# EAGLE design MasterThesis (EAGLE 6.2)
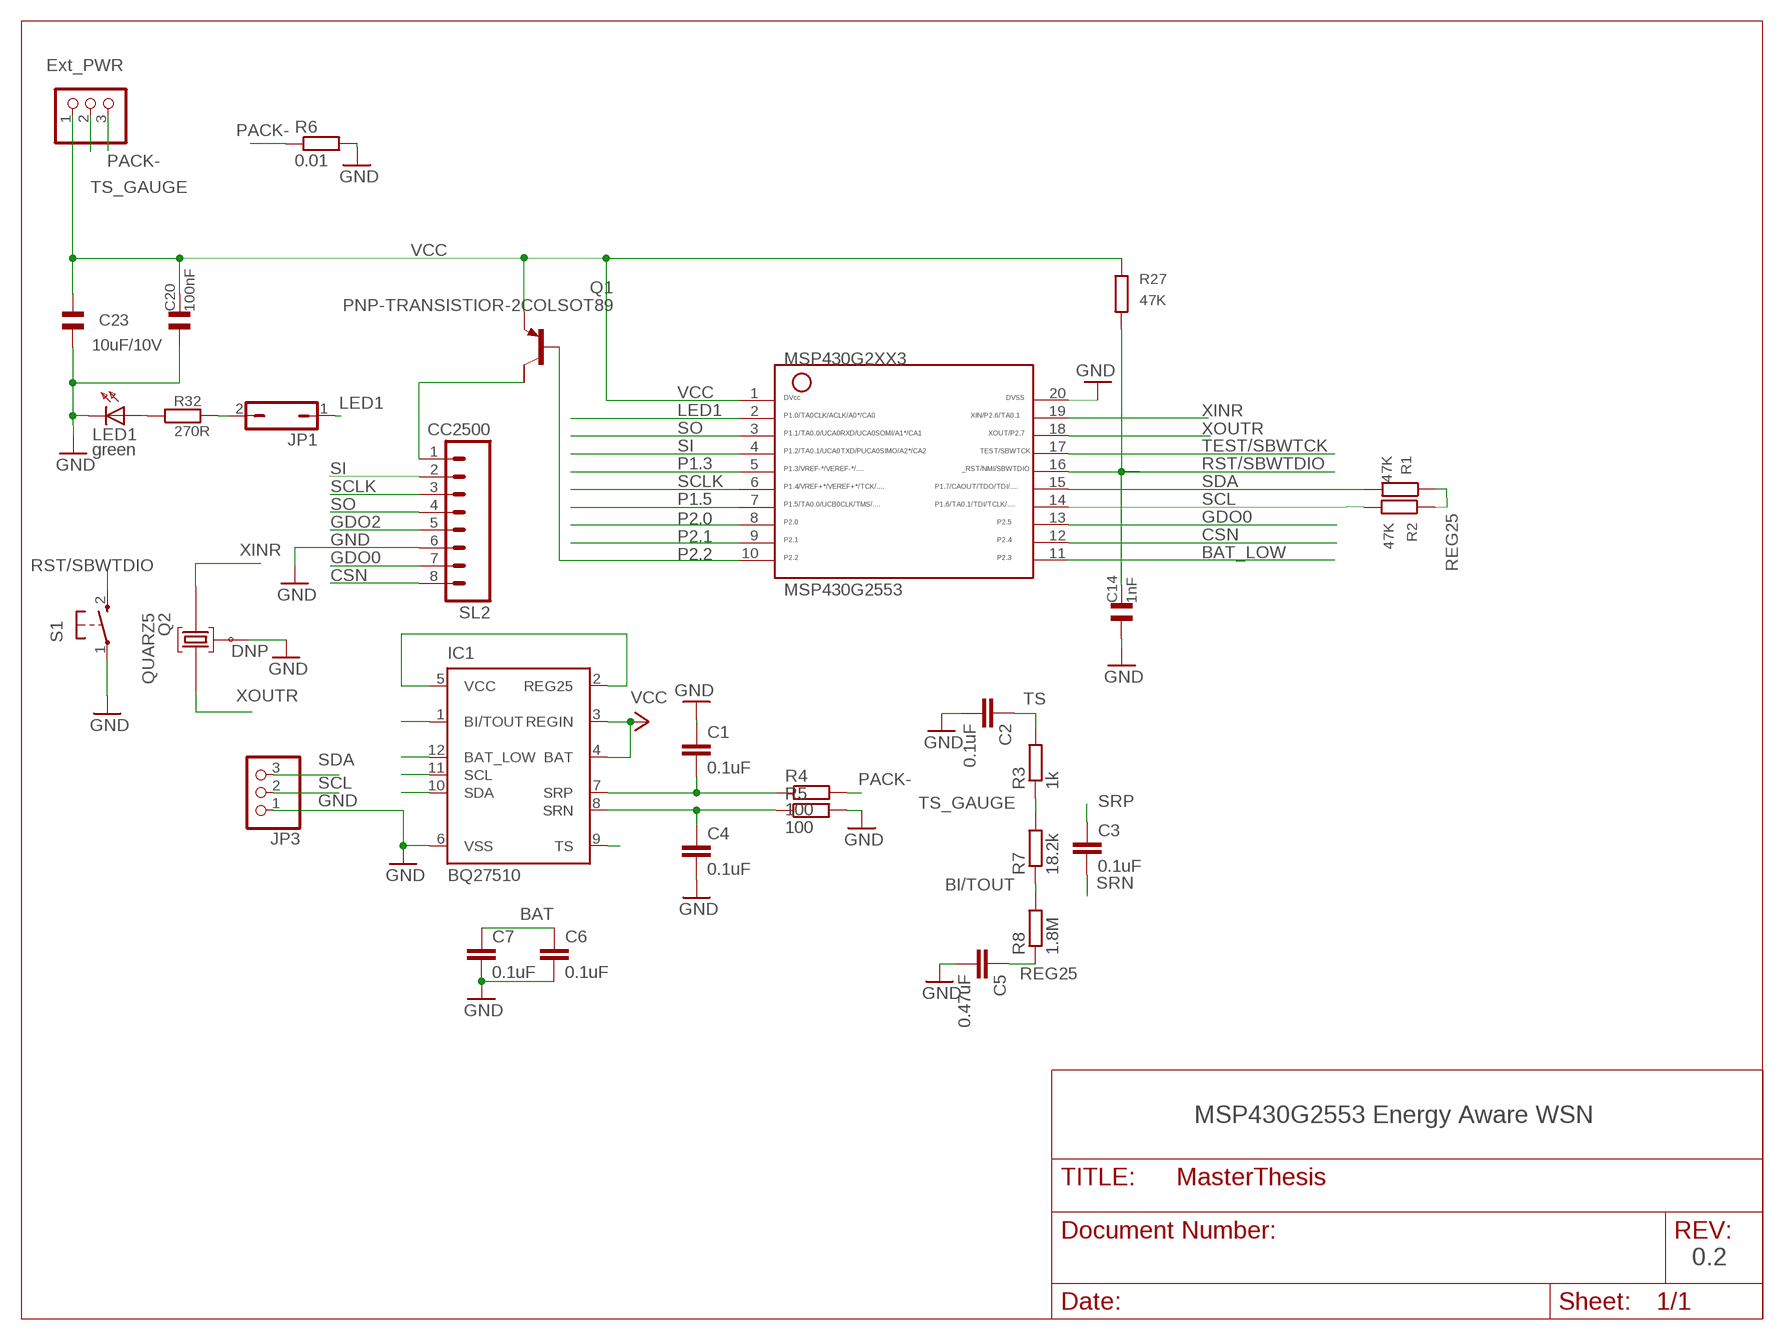
[diagram p0: schematic, sheet 1]

## Parts
C1  0.1uF  C-EU025-024X044  [C025-024X044]
C2  0.1uF  C-EU025-024X044  [C025-024X044]
C3  0.1uF  C-EU025-024X044  [C025-024X044]
C4  0.1uF  C-EU025-024X044  [C025-024X044]
C5  0.47uF  C-EU025-024X044  [C025-024X044]
C6  0.1uF  C-EU025-024X044  [C025-024X044]
C7  0.1uF  C-EU025-024X044  [C025-024X044]
C14  1nF  C_SMD0603  [0603]
C20  100nF  C_SMD0603  [0603]
C23  10uF/10V  C_0805  [0805]
IC1  BQ27510  [DRZ]
J6  PINHD-1X3  [1X03]
JP1  JP1Q  [JP1]
JP3  PINHD-1X3/90  [1X03/90]
LED1  green  LED_0603D0603  [DIODE0603]
MSP430G2553  MSP430G2553  G2XX3---N20  [N20]
Q1  PNP-TRANSISTIOR-2COLSOT89  [SOT89]
Q2  QUARZ5  [QUARZ5]
R1  47K  R_SMDR0603  [0603]
R2  47K  R_SMDR0603  [0603]
R3  1k  R-EU_0204/5  [0204/5]
R4  100  R-EU_0204/5  [0204/5]
R5  100  R-EU_0204/5  [0204/5]
R6  0.01  R-EU_0204/5  [0204/5]
R7  18.2k  R-EU_0204/5  [0204/5]
R8  1.8M  R-EU_0204/5  [0204/5]
R27  47K  R_SMDR0603  [0603]
R32  270R  R_SMDR0603  [0603]
S1  PB  [PBTH]
SL2  CC2500  M08  [08P]

## Nets
BAT: C6.1 C7.1 IC1.3(REGIN) IC1.4(BAT) ; supply symbol labelled VCC
BAT_LOW: IC1.12(BAT_LOW) MSP430G2553.11
BI/TOUT: IC1.1(BI/TOUT) R7.1 R8.2
CSN: MSP430G2553.12 SL2.8
GDO0: MSP430G2553.13 SL2.7
GDO2: SL2.5
GND [Ground]: C1.1 C2.2 C4.2 C5.2 C6.2 C7.2 C14.1 C20.1 C23.1 IC1.6(VSS) JP3.1 LED1.K(C) MSP430G2553.20 Q2.GND@0 R5.2 R6.2 S1.1(P) SL2.6
LED1: JP1.1 MSP430G2553.2
N$1: Q1.2(C) SL2.1
N$2: JP1.2 R32.2
N$34: LED1.A R32.1
P1.3: MSP430G2553.5
P1.5: MSP430G2553.7
P2.0: MSP430G2553.8
P2.1: MSP430G2553.9
P2.2: MSP430G2553.10 Q1.1(B)
PACK- [Ground]: J6.3 R4.2 R6.1
REG25: C5.1 IC1.2(REG25) IC1.5(VCC) R1.1 R2.1 R8.1
RST/SBWTDIO: C14.2 MSP430G2553.16 R27.2 S1.2(S)
SCL: IC1.11(SCL) JP3.2 MSP430G2553.14 R2.2
SCLK: MSP430G2553.6 SL2.3
SDA: IC1.10(SDA) JP3.3 MSP430G2553.15 R1.2
SI: MSP430G2553.4 SL2.2
SO: MSP430G2553.3 SL2.4
SRN: C3.2 C4.1 IC1.8(SRN) R5.1
SRP: C1.2 C3.1 IC1.7(SRP) R4.1
TEST/SBWTCK: MSP430G2553.17
TS: C2.1 IC1.9(TS) R3.2
TS_GAUGE [Ground]: J6.2 R3.1 R7.2
VCC: C20.2 C23.2 J6.1 MSP430G2553.1 Q1.3(E) R27.1
XINR: MSP430G2553.19 Q2.2
XOUTR: MSP430G2553.18 Q2.1
Unconnected: Q1.2@1(C/)

## Notes on the sheet
- Ext_PWR
- DNP
- MSP430G2553 Energy Aware WSN
- 0.2

## Power pins joined to a net without a drawn wire
PWPD: IC1.EXP@1(PWPD) IC1.EXP@2(PWPD) IC1.EXP@3(PWPD) IC1.EXP@4(PWPD) IC1.EXP@5(PWPD) IC1.EXP@6(PWPD) IC1.EXP@7(PWPD) IC1.EXP@8(PWPD) IC1.EXP@9(PWPD)

## Library data of the parts
C1-C7 = rcl:C-EU: CAPACITOR, European symbol
C14 C20 = ssmd:C_SMD
C23 = ssmd:C_0805
IC1 = texas:BQ27510: System-Side Impedance Track? Fuel Gauge Source: bq27500-v100.pdf; MPN: BQ27510DRZT; OC_FARNELL: 1710789; OC_NEWARK: 50P9379
J6 JP3 = pinhead:PINHD-1X3: PIN HEADER
JP1 = jumper:JP1Q: JUMPER
LED1 = smd:LED_0603
MSP430G2553 = TI_MSP430_v16:G2XX3---N20: MSP430G2XX1 PDIP (N) 20 Pin Package
Q1 = semicon-smd-ipc:PNP-TRANSISTIOR-2COL: PNP TRANSISTOR 2 colletor pins
Q2 = sMSP430:QUARZ5
R1 R2 R27 R32 = ssmd:R_SMD
R3-R8 = rcl:R-EU_: RESISTOR, European symbol
S1 = electricalmeter:PB: OMRON SWITCH
SL2 = con-amp-quick:M08: AMP QUICK CONNECTOR; OC_FARNELL: unknown; OC_NEWARK: unknown

## Net classes
0 default: width 0.254 mm
1 Ground: width 0.1 mm, drill 0.2 mm

## Board
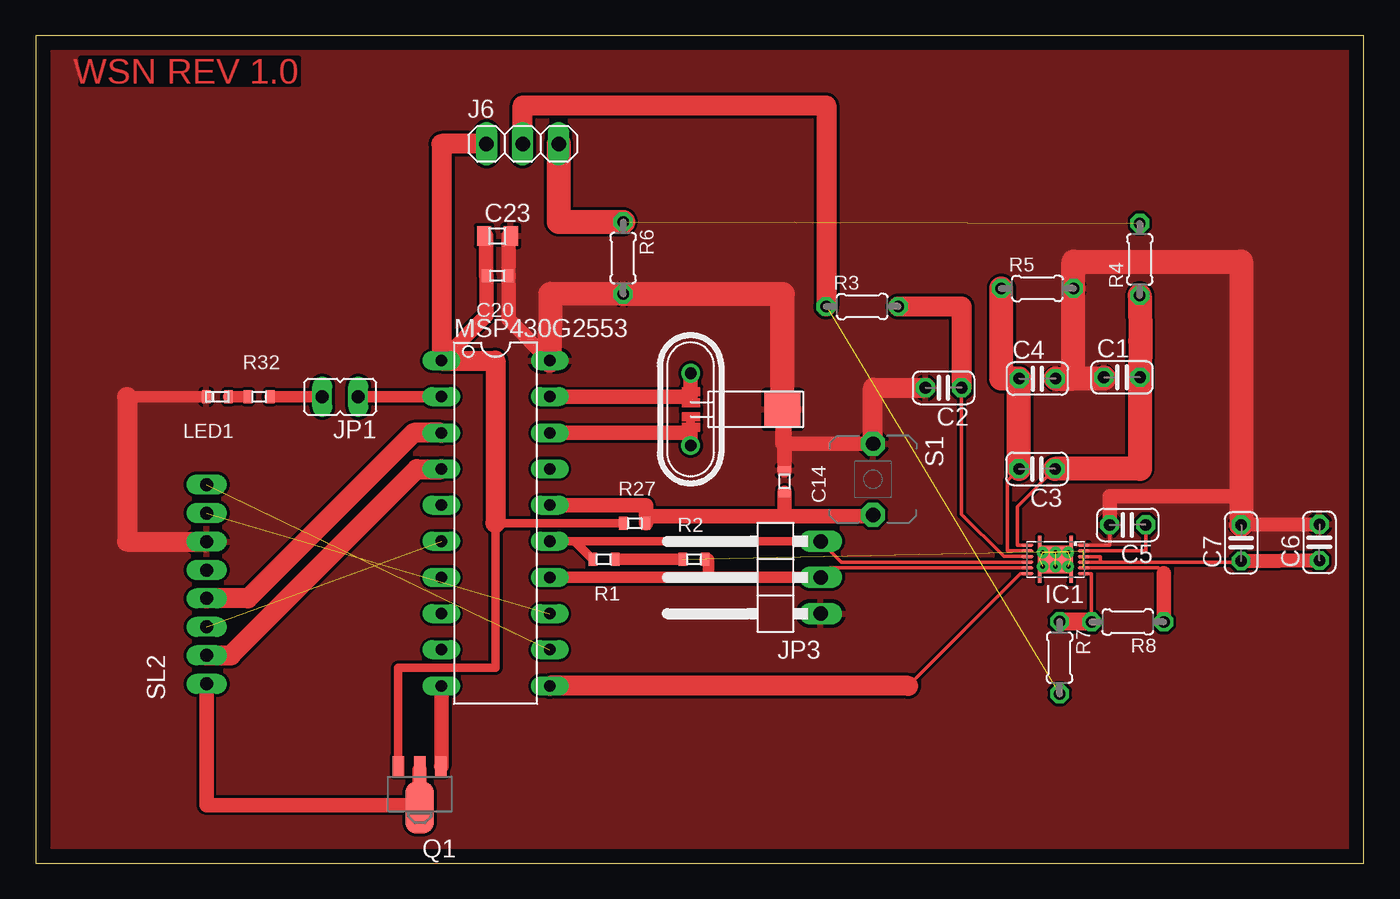
[diagram p1: board, top side]

Size 93.41 x 58.18 mm. Coordinates in mm from the lower left corner, seen from the top.
Outline: 0.01,0 93.41,0 93.41,58.18 0,58.18 0.01,0
Copper layers (1*16): Top 0.035mm / dielectric 1.5mm / Bottom 0.035mm
Design rules: minimum track width 10mil, minimum drill 24mil, track to track 8mil, track to pad 8mil, pad to pad 8mil, via to via 8mil, smd to smd 8mil, copper to edge 40mil, drill to drill 8mil, minimum pad ring 10mil, minimum via ring 8mil, stop-mask expansion 4mil, vias tented up to drill 0mil, thermal gap 10mil

### Footprints (pad centres in the part's own frame; a part is rotated, then mirrored left to right if it is on the bottom)
C025-024X044 = drill 0.813 octagon: 1 -1.27,0; 2 1.27,0
0603 = smd 0.6 x 0.9: 1 -0.787,0; 2 0.787,0
0805 = smd 1 x 1.4: 1 -0.94,0; 2 0.94,0
DRZ = smd 0.85 x 0.2: 1 -1.975,1; 2 -1.975,0.6; 3 -1.975,0.2; 4 -1.975,-0.2; 5 -1.975,-0.6; 6 -1.975,-1; 7 1.975,-1; 8 1.975,-0.6; 9 1.975,-0.2; 10 1.975,0.2; 11 1.975,0.6; 12 1.975,1 | smd 2.45 x 1.95: EXP@1 0,0 | smd 0.25 x 3.3: EXP@2 -1.1,0; EXP@3 1.1,0 | drill 0.3 pad 0.406: EXP@4 -0.9,0.5; EXP@5 0,0.5; EXP@6 0.9,0.5; EXP@7 -0.9,-0.5; EXP@8 0,-0.5; EXP@9 0.9,-0.5
1X03 = drill 1.016 long: 1 -2.54,0; 2 0,0; 3 2.54,0
JP1 = drill 0.914 long: 1 0,-1.27; 2 0,1.27
1X03/90 = drill 1.016 long: 1 -2.54,-3.81; 2 0,-3.81; 3 2.54,-3.81
DIODE0603 = smd 0.6 x 0.9: A -0.787,0; K 0.787,0
N20 = drill 0.813 long: 1 -11.435,-3.81; 2 -8.895,-3.81; 3 -6.355,-3.81; 4 -3.815,-3.81; 5 -1.275,-3.81; 6 1.265,-3.81; 7 3.805,-3.81; 8 6.345,-3.81; 9 8.885,-3.81; 10 11.425,-3.81; 11 11.425,3.81; 12 8.885,3.81; 13 6.345,3.81; 14 3.805,3.81; 15 1.265,3.81; 16 -1.275,3.81; 17 -3.815,3.81; 18 -6.355,3.81; 19 -8.895,3.81; 20 -11.435,3.81
SOT89 = smd 0.8 x 1.4: 1 -1.499,-1.981; 3 1.499,-1.981 | smd 0.8 x 1.9: 2 0,-1.727 | smd 2.032 x 3.65: 2@1 0,0.94
QUARZ5 = drill 0.813: 1 1.53,1.773; 2 1.52,-3.303 | smd 2.54 x 2.54: GND@0 -4.941,-0.762
0204/5 = drill 0.813 octagon: 1 -2.54,0; 2 2.54,0
PBTH = drill 1.016 pad 1.676 octagon: 1 -0.001,0.001; 2 5.001,0.001
08P = drill 0.914 long: 1 -8.78,0.026; 2 -6.776,0.022; 3 -4.778,0.022; 4 -2.773,0.023; 5 -0.775,0.021; 6 1.222,0.02; 7 3.23,0.024; 8 5.225,0.022; 9 -8.78,0.026; 10 -8.78,0.026; 11 -8.78,0.026; 12 -8.78,0.026; 13 -6.776,0.022; 14 -6.776,0.022; 15 -6.776,0.022; 16 -6.776,0.022; 17 -6.78,0.022; 18 -6.776,0.022; 19 -4.778,0.022; 20 -4.778,0.022; 21 -4.778,0.022; 22 -0.775,0.021; 23 -0.775,0.021

### Placement (x,y rotation side)
C1  76.39,34.16 0 top
C2  63.84,33.43 180 top
C3  70.42,27.72 180 top
C4  70.45,34.06 0 top
C5  76.8,23.79 180 top
C6  90.27,22.56 90 top
C7  84.77,22.52 90 top
C14  52.67,26.82 270 top
C20  32.47,41.3 180 top
C23  32.47,44.09 180 top
IC1  71.72,21.36 180 top
J6  34.25,50.57 0 top
JP1  21.42,32.79 90 top
JP3  51.4,20.09 90 top
LED1  12.79,32.79 180 top
MSP430G2553  32.35,23.9 270 top
Q1  27.01,4.85 180 top
Q2  47.59,31.14 180 top
R1  39.97,21.36 180 top
R2  46.29,21.36 0 top
R3  58.13,39.14 0 top
R4  77.65,42.44 90 top
R5  70.45,40.41 0 top
R6  41.31,42.55 270 top
R7  72.01,14.45 270 top
R8  76.8,16.97 180 top
R27  42.13,23.9 0 top
R32  15.71,32.79 0 top
S1  58.89,29.49 270 top
SL2  12.05,21.39 90 top

### Tracks (layer width: path | path; a pad name or v marks a point on that pad's centre or on a via)
BAT
  Top 0.254: C7.1 84.77,21.16 74.88,21.16 | 74.88,21.16 IC1.3 | IC1.4 74.88,21.56 74.88,21.16
  Top 1.016: C6.1 C7.1
BAT_LOW
  Top 0.254: IC1.12 69.26,20.36 61.37,12.47
  Top 1.422: 61.37,12.47 MSP430G2553.11
BI/TOUT
  Top 0.254: IC1.1 74.26,20.36 R8.2
  Top 1.27: R8.2 72.01,16.97 R7.1
CSN  (1 unrouted)
GDO0  (1 unrouted)
GND
  Top 0.254: C5.2 75.53,22.36 IC1.6
  Top 0.61: C23.1 33.26,44.09
  Top 0.813: 6.44,32.79 LED1.K
  Top 1.016: MSP430G2553.20 33.26,38.23 C20.1 33.26,44.09 | S1.1 52.53,29.49 Q2.GND@0 52.67,31.9 C14.1 | C6.2 C7.2 84.77,25.81 75.54,25.81 75.54,23.79 C5.2
  Top 1.422: 6.44,32.79 6.44,22.61 SL2.6 | S1.1 58.89,33.43 C2.2
  Top 1.676: MSP430G2553.20 36.18,40.03 R6.2 52.53,40.01 Q2.GND@0 | C1.1 75.12,34.06 72.99,34.06 | C4.2 72.99,34.06 | 72.99,34.06 R5.2 72.99,42.29 84.77,42.29 C7.2
  pour Top: 0.09,0.03 93.56,0.03 93.56,58.19 0.09,58.19
LED1
  Top 0.813: JP1.1 MSP430G2553.2
N$1
  Top 1.016: Q1.2 27.01,4.09 12.03,4.09 SL2.1 | SL2.1
N$2
  Top 0.813: R32.2 JP1.2
N$34
  Top 0.813: LED1.A R32.1
P2.2
  Top 1.016: MSP430G2553.10 28.54,6.83 Q1.1
PACK-  (1 unrouted)
  Top 1.676: J6.3 36.79,45.09 R6.1
PWPD  (8 unrouted)
REG25  (2 unrouted)
  Top 0.254: IC1.5 78.07,21.96 C5.1 | 79.35,20.4 78.93,20.76 IC1.2
  Top 0.813: R1.1 R2.1
  Top 1.016: R8.1 79.35,20.4
RST/SBWTDIO
  Top 1.016: MSP430G2553.16 42.91,25.18 42.91,24.41 | 42.91,24.41 R27.2 | S1.2 58.89,24.41 52.79,24.41 52.67,24.41 | 52.67,24.41 42.91,24.41 | C14.2 52.67,24.41
SCL
  Top 0.254: IC1.11 55.88,20.76 JP3.2
  Top 0.813: JP3.2 47.33,20.09 | 47.33,20.09 MSP430G2553.14 | R2.2 47.33,21.36 47.33,20.09
SCLK  (1 unrouted)
SDA
  Top 0.254: IC1.10 56.68,21.16 JP3.3
  Top 0.61: R1.2 37.9,22.64 MSP430G2553.15 JP3.3
SI
  Top 1.422: SL2.2 13.72,14.61 26.81,27.7 28.52,27.7 MSP430G2553.4
SO
  Top 1.422: MSP430G2553.3 26.59,30.26 14.95,18.62 SL2.4
SRN
  Top 0.254: IC1.8 68.33,21.96 68.33,26.9 C3.2
  Top 1.676: R5.1 67.91,34.06 C4.1 69.15,34.06 C3.2
SRP
  Top 0.254: C3.1 69.04,25.07 69.04,22.34 69.06,22.36 IC1.7
  Top 1.676: R4.1 77.67,36.7 C1.2 77.66,27.72 C3.1
TS
  Top 0.254: C2.1 65.11,24.55 68.1,21.56 IC1.9
  Top 1.422: R3.2 65.11,39.14 C2.1
TS_GAUGE  (1 unrouted)
  Top 1.422: J6.2 34.25,53.28 55.61,53.28 55.61,39.14 R3.1
VCC
  Top 0.61: C23.2 31.69,44.09 | C20.2 31.71,41.3 | R27.1 32.35,23.9 32.36,13.74 25.5,13.74 25.49,6.83 Q1.3
  Top 1.016: 31.69,44.09 C20.2 | 31.71,41.3 31.71,38.51 MSP430G2553.1
  Top 1.422: J6.1 28.54,50.57 MSP430G2553.1 32.35,35.34 32.35,23.9
XINR
  Top 1.016: MSP430G2553.19 46.07,32.8 Q2.2
XOUTR
  Top 1.016: MSP430G2553.18 46.06,30.26 Q2.1

### Text on the board
Top: WSN REV 1.0